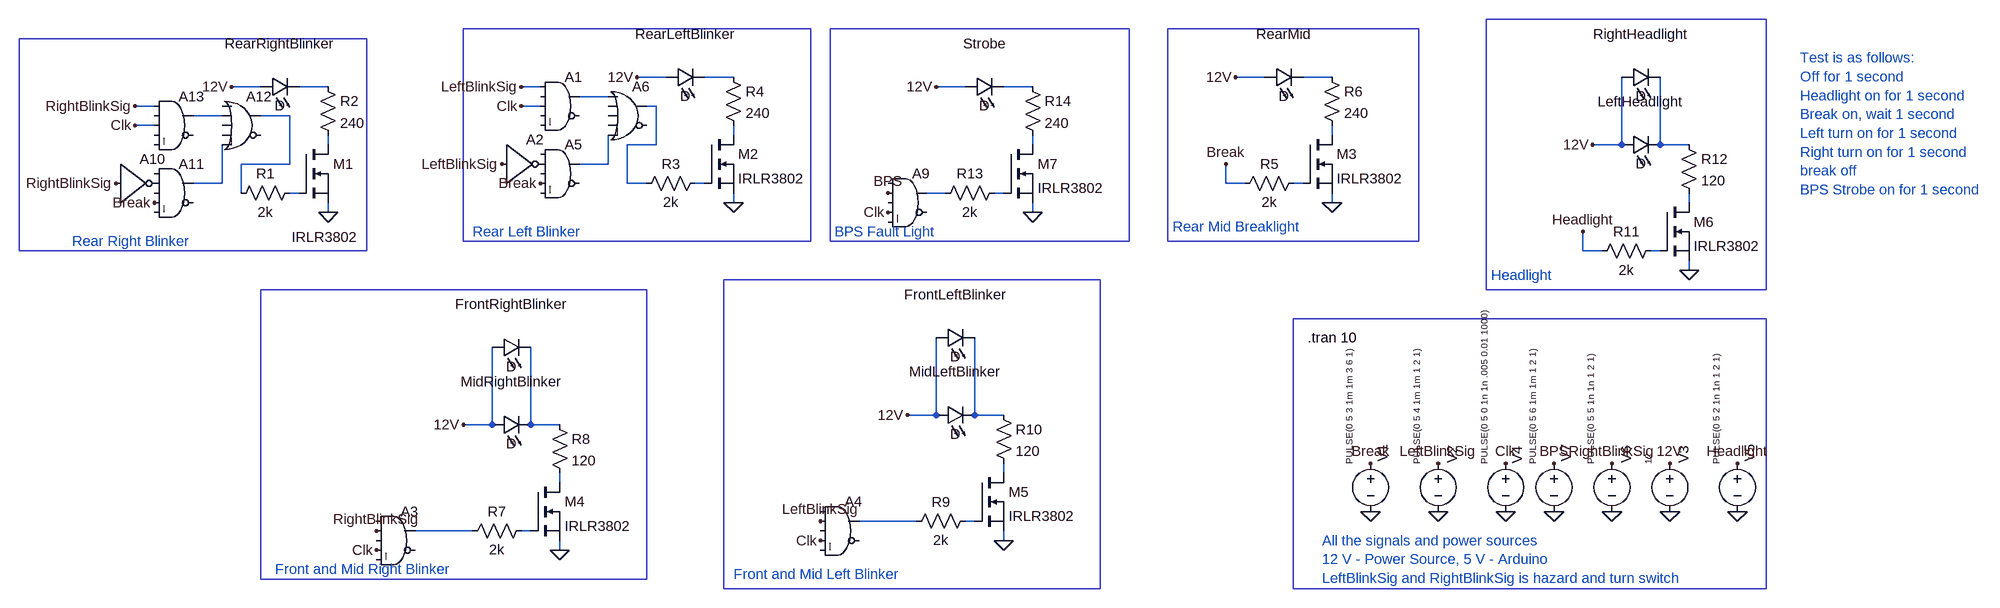
[diagram p0: schematic Lighting_System_LTSpice.asc]
Lighting_System_LTSpice.asc, the LTspice schematic file:
Version 4
SHEET 1 2324 832
WIRE -1680 -1456 -1728 -1456
WIRE -1568 -1456 -1616 -1456
WIRE -688 -1456 -736 -1456
WIRE -576 -1456 -624 -1456
WIRE -2352 -1440 -2400 -1440
WIRE -2240 -1440 -2288 -1440
WIRE -1888 -1440 -1920 -1440
WIRE -1184 -1440 -1232 -1440
WIRE -1072 -1440 -1120 -1440
WIRE -1776 -1424 -1824 -1424
WIRE -2528 -1408 -2560 -1408
WIRE -1888 -1408 -1920 -1408
WIRE -1696 -1408 -1712 -1408
WIRE -2416 -1392 -2464 -1392
WIRE -2304 -1392 -2352 -1392
WIRE -2528 -1376 -2560 -1376
WIRE -1568 -1360 -1568 -1376
WIRE -576 -1360 -576 -1376
WIRE -2240 -1344 -2240 -1360
WIRE -1696 -1344 -1696 -1408
WIRE -1696 -1344 -1744 -1344
WIRE -1072 -1344 -1072 -1360
WIRE -96 -1344 -96 -1456
WIRE -96 -1344 -144 -1344
WIRE -32 -1344 -32 -1456
WIRE 16 -1344 -32 -1344
WIRE -2304 -1312 -2304 -1392
WIRE -2304 -1312 -2384 -1312
WIRE -1776 -1312 -1776 -1360
WIRE -1776 -1312 -1824 -1312
WIRE -2416 -1280 -2416 -1344
WIRE -2416 -1280 -2464 -1280
WIRE -1744 -1280 -1744 -1344
WIRE -1712 -1280 -1744 -1280
WIRE -1616 -1280 -1632 -1280
WIRE -752 -1280 -752 -1312
WIRE -720 -1280 -752 -1280
WIRE -624 -1280 -640 -1280
WIRE -2384 -1264 -2384 -1312
WIRE -2288 -1264 -2304 -1264
WIRE -1216 -1264 -1248 -1264
WIRE -1120 -1264 -1136 -1264
WIRE -1568 -1248 -1568 -1264
WIRE -576 -1248 -576 -1264
WIRE 16 -1248 16 -1264
WIRE -2240 -1232 -2240 -1248
WIRE -1072 -1232 -1072 -1248
WIRE -160 -1168 -160 -1200
WIRE -128 -1168 -160 -1168
WIRE -32 -1168 -48 -1168
WIRE 16 -1136 16 -1152
WIRE -1232 -896 -1232 -1024
WIRE -1232 -896 -1280 -896
WIRE -1168 -896 -1168 -1024
WIRE -1120 -896 -1168 -896
WIRE -1968 -880 -1968 -1008
WIRE -1968 -880 -2016 -880
WIRE -1904 -880 -1904 -1008
WIRE -1856 -880 -1904 -880
WIRE -1120 -800 -1120 -816
WIRE -1856 -784 -1856 -800
WIRE -1264 -720 -1360 -720
WIRE -1168 -720 -1184 -720
WIRE -2000 -704 -2096 -704
WIRE -1904 -704 -1920 -704
WIRE -1120 -688 -1120 -704
WIRE -1856 -672 -1856 -688
FLAG -400 -816 LeftBlinkSig
FLAG -288 -816 Clk
FLAG -512 -816 Break
FLAG -512 -736 0
FLAG -400 -736 0
FLAG -288 -736 0
FLAG -1568 -1248 0
FLAG -1728 -1456 12V
FLAG -112 -816 RightBlinkSig
FLAG -112 -736 0
FLAG -16 -816 12V
FLAG -16 -736 0
FLAG 96 -816 Headlight
FLAG 96 -736 0
FLAG -576 -1248 0
FLAG -736 -1456 12V
FLAG -752 -1312 Break
FLAG -1856 -672 0
FLAG -2016 -880 12V
FLAG -2160 -672 Clk
FLAG -2160 -704 RightBlinkSig
FLAG -1120 -688 0
FLAG -1280 -896 12V
FLAG -1424 -688 Clk
FLAG -1424 -720 LeftBlinkSig
FLAG 16 -1136 0
FLAG -144 -1344 12V
FLAG -160 -1200 Headlight
FLAG -1072 -1232 0
FLAG -1232 -1440 12V
FLAG -208 -816 BPS
FLAG -208 -736 0
FLAG -2240 -1232 0
FLAG -2400 -1440 12V
FLAG -1312 -1232 Clk
FLAG -1312 -1264 BPS
FLAG -2560 -1376 Clk
FLAG -2560 -1408 RightBlinkSig
FLAG -2528 -1248 Break
FLAG -2592 -1280 RightBlinkSig
FLAG -1920 -1408 Clk
FLAG -1920 -1440 LeftBlinkSig
FLAG -1888 -1280 Break
FLAG -1952 -1312 LeftBlinkSig
SYMBOL voltage -512 -832 R0
WINDOW 0 21 14 VLeft 2
WINDOW 3 -35 18 VLeft 1
WINDOW 123 0 0 Left 0
WINDOW 39 0 0 Left 0
SYMATTR InstName V1
SYMATTR Value PULSE(0 5 3 1m 1m 3 6 1)
SYMBOL voltage -400 -832 R0
WINDOW 0 24 16 VLeft 2
WINDOW 3 -35 18 VLeft 1
WINDOW 123 0 0 Left 0
WINDOW 39 0 0 Left 0
SYMATTR InstName V2
SYMATTR Value PULSE(0 5 4 1m 1m 1 2 1)
SYMBOL voltage -288 -832 R0
WINDOW 0 20 17 VLeft 2
WINDOW 3 -35 18 VLeft 1
WINDOW 123 0 0 Left 0
WINDOW 39 0 0 Left 0
SYMATTR InstName V4
SYMATTR Value PULSE(0 5 0 1n 1n .005 0.01 1000)
SYMBOL nmos -1616 -1360 R0
SYMATTR InstName M2
SYMATTR Value IRLR3802
SYMBOL res -1616 -1296 R90
WINDOW 0 0 56 VBottom 2
WINDOW 3 32 56 VTop 2
SYMATTR InstName R3
SYMATTR Value 2k
SYMBOL res -1584 -1472 R0
SYMATTR InstName R4
SYMATTR Value 240
SYMBOL voltage -112 -832 R0
WINDOW 0 24 16 VLeft 2
WINDOW 3 -35 18 VLeft 1
WINDOW 123 0 0 Left 0
WINDOW 39 0 0 Left 0
SYMATTR InstName V6
SYMATTR Value PULSE(0 5 5 1n 1n 1 2 1)
SYMBOL LED -1680 -1440 R270
WINDOW 0 72 32 VTop 2
WINDOW 3 0 32 VBottom 2
SYMATTR InstName RearLeftBlinker
SYMBOL voltage -16 -832 R0
WINDOW 0 24 16 VLeft 2
WINDOW 3 -35 18 VLeft 1
WINDOW 123 0 0 Left 0
WINDOW 39 0 0 Left 0
SYMATTR InstName V3
SYMATTR Value 12
SYMBOL voltage 96 -832 R0
WINDOW 0 21 14 VLeft 2
WINDOW 3 -35 18 VLeft 1
WINDOW 123 0 0 Left 0
WINDOW 39 0 0 Left 0
SYMATTR InstName V5
SYMATTR Value PULSE(0 5 2 1n 1n 1 2 1)
SYMBOL nmos -624 -1360 R0
SYMATTR InstName M3
SYMATTR Value IRLR3802
SYMBOL res -624 -1296 R90
WINDOW 0 0 56 VBottom 2
WINDOW 3 32 56 VTop 2
SYMATTR InstName R5
SYMATTR Value 2k
SYMBOL res -592 -1472 R0
SYMATTR InstName R6
SYMATTR Value 240
SYMBOL LED -688 -1440 R270
WINDOW 0 72 32 VTop 2
WINDOW 3 0 32 VBottom 2
SYMATTR InstName RearMid
SYMBOL nmos -1904 -784 R0
SYMATTR InstName M4
SYMATTR Value IRLR3802
SYMBOL res -1904 -720 R90
WINDOW 0 0 56 VBottom 2
WINDOW 3 32 56 VTop 2
SYMATTR InstName R7
SYMATTR Value 2k
SYMBOL res -1872 -896 R0
SYMATTR InstName R8
SYMATTR Value 120
SYMBOL LED -1968 -864 R270
WINDOW 0 72 32 VTop 2
WINDOW 3 0 32 VBottom 2
SYMATTR InstName MidRightBlinker
SYMBOL Digital\\and -2128 -752 R0
SYMATTR InstName A3
SYMATTR SpiceLine Vhigh=5
SYMBOL LED -1968 -992 R270
WINDOW 0 72 32 VTop 2
WINDOW 3 0 32 VBottom 2
SYMATTR InstName FrontRightBlinker
SYMBOL nmos -1168 -800 R0
SYMATTR InstName M5
SYMATTR Value IRLR3802
SYMBOL res -1168 -736 R90
WINDOW 0 0 56 VBottom 2
WINDOW 3 32 56 VTop 2
SYMATTR InstName R9
SYMATTR Value 2k
SYMBOL res -1136 -912 R0
SYMATTR InstName R10
SYMATTR Value 120
SYMBOL LED -1232 -880 R270
WINDOW 0 72 32 VTop 2
WINDOW 3 0 32 VBottom 2
SYMATTR InstName MidLeftBlinker
SYMBOL Digital\\and -1392 -768 R0
SYMATTR InstName A4
SYMATTR SpiceLine Vhigh=5
SYMBOL LED -1232 -1008 R270
WINDOW 0 72 32 VTop 2
WINDOW 3 0 32 VBottom 2
SYMATTR InstName FrontLeftBlinker
SYMBOL nmos -32 -1248 R0
SYMATTR InstName M6
SYMATTR Value IRLR3802
SYMBOL res -32 -1184 R90
WINDOW 0 0 56 VBottom 2
WINDOW 3 32 56 VTop 2
SYMATTR InstName R11
SYMATTR Value 2k
SYMBOL res 0 -1360 R0
SYMATTR InstName R12
SYMATTR Value 120
SYMBOL LED -96 -1328 R270
WINDOW 0 72 32 VTop 2
WINDOW 3 0 32 VBottom 2
SYMATTR InstName LeftHeadlight
SYMBOL LED -96 -1440 R270
WINDOW 0 72 32 VTop 2
WINDOW 3 0 32 VBottom 2
SYMATTR InstName RightHeadlight
SYMBOL nmos -1120 -1344 R0
SYMATTR InstName M7
SYMATTR Value IRLR3802
SYMBOL res -1120 -1280 R90
WINDOW 0 0 56 VBottom 2
WINDOW 3 32 56 VTop 2
SYMATTR InstName R13
SYMATTR Value 2k
SYMBOL res -1088 -1456 R0
SYMATTR InstName R14
SYMATTR Value 240
SYMBOL LED -1184 -1424 R270
WINDOW 0 72 32 VTop 2
WINDOW 3 0 32 VBottom 2
SYMATTR InstName Strobe
SYMBOL voltage -208 -832 R0
WINDOW 0 21 14 VLeft 2
WINDOW 3 -35 18 VLeft 1
WINDOW 123 0 0 Left 0
WINDOW 39 0 0 Left 0
SYMATTR InstName V7
SYMATTR Value PULSE(0 5 6 1m 1m 1 2 1)
SYMBOL nmos -2288 -1344 R0
WINDOW 3 -12 153 Left 2
SYMATTR InstName M1
SYMATTR Value IRLR3802
SYMBOL res -2288 -1280 R90
WINDOW 0 0 56 VBottom 2
WINDOW 3 32 56 VTop 2
SYMATTR InstName R1
SYMATTR Value 2k
SYMBOL res -2256 -1456 R0
SYMATTR InstName R2
SYMATTR Value 240
SYMBOL LED -2352 -1424 R270
WINDOW 0 72 32 VTop 2
WINDOW 3 0 32 VBottom 2
SYMATTR InstName RearRightBlinker
SYMBOL Digital\\and -1280 -1312 R0
SYMATTR InstName A9
SYMATTR SpiceLine Vhigh=5
SYMBOL Digital\\and -2496 -1440 R0
SYMATTR InstName A13
SYMATTR SpiceLine Vhigh=5V
SYMBOL Digital\\inv -2592 -1344 R0
SYMATTR InstName A10
SYMATTR SpiceLine Vhigh=5V
SYMBOL Digital\\and -2496 -1328 R0
SYMATTR InstName A11
SYMATTR SpiceLine Vhigh=5V
SYMBOL Digital\\or -2384 -1440 R0
SYMATTR InstName A12
SYMATTR SpiceLine Vhigh=5V
SYMBOL Digital\\and -1856 -1472 R0
SYMATTR InstName A1
SYMATTR SpiceLine Vhigh=5V
SYMBOL Digital\\inv -1952 -1376 R0
SYMATTR InstName A2
SYMATTR SpiceLine Vhigh=5V
SYMBOL Digital\\and -1856 -1360 R0
SYMATTR InstName A5
SYMATTR SpiceLine Vhigh=5V
SYMBOL Digital\\or -1744 -1456 R0
SYMATTR InstName A6
SYMATTR SpiceLine Vhigh=5V
TEXT -616 -1024 Left 2 !.tran 10
TEXT -592 -688 Left 2 ;All the signals and power sources\n12 V - Power Source, 5 V - Arduino\nLeftBlinkSig and RightBlinkSig is hazard and turn switch
TEXT -2664 -1184 Left 2 ;Rear Right Blinker
TEXT -2000 -1200 Left 2 ;Rear Left Blinker
TEXT -1400 -1200 Left 2 ;BPS Fault Light
TEXT -840 -1208 Left 2 ;Rear Mid Breaklight
TEXT -312 -1128 Left 2 ;Headlight
TEXT -1568 -632 Left 2 ;Front and Mid Left Blinker
TEXT -2328 -640 Left 2 ;Front and Mid Right Blinker
TEXT 200 -1488 Left 2 ;Test is as follows:\nOff for 1 second\nHeadlight on for 1 second\nBreak on, wait 1 second\nLeft turn on for 1 second\nRight turn on for 1 second\nbreak off\nBPS Strobe on for 1 second
RECTANGLE Normal -2016 -1184 -1440 -1536
RECTANGLE Normal -2352 -624 -1712 -1104
RECTANGLE Normal -848 -1536 -432 -1184
RECTANGLE Normal 144 -1552 -320 -1104
RECTANGLE Normal 144 -608 -640 -1056
RECTANGLE Normal -2752 -1168 -2176 -1520
RECTANGLE Normal -912 -1536 -1408 -1184
RECTANGLE Normal -960 -1120 -1584 -608

The netlist it stands for:
* Lighting_System_LTSpice.asc
V1 Break 0 PULSE(0 5 3 1m 1m 3 6 1)
V2 LeftBlinkSig 0 PULSE(0 5 4 1m 1m 1 2 1)
V4 Clk 0 PULSE(0 5 0 1n 1n .005 0.01 1000)
M2 N009 N016 0 0 IRLR3802
R3 N016 N006 2k
R4 N001 N009 240
V6 RightBlinkSig 0 PULSE(0 5 5 1n 1n 1 2 1)
D§RearLeftBlinker 12V N001 D
V3 12V 0 12
V5 Headlight 0 PULSE(0 5 2 1n 1n 1 2 1)
M3 N010 N017 0 0 IRLR3802
R5 N017 Break 2k
R6 N002 N010 240
D§RearMid 12V N002 D
M4 N026 N030 0 0 IRLR3802
R7 N030 N029 2k
R8 N024 N026 120
D§MidRightBlinker 12V N024 D
A3 0 RightBlinkSig 0 Clk 0 0 N029 0 AND Vhigh=5
D§FrontRightBlinker 12V N024 D
M5 N025 N028 0 0 IRLR3802
R9 N028 N027 2k
R10 N023 N025 120
D§MidLeftBlinker 12V N023 D
A4 0 LeftBlinkSig 0 Clk 0 0 N027 0 AND Vhigh=5
D§FrontLeftBlinker 12V N023 D
M6 N021 N022 0 0 IRLR3802
R11 N022 Headlight 2k
R12 N013 N021 120
D§LeftHeadlight 12V N013 D
D§RightHeadlight 12V N013 D
M7 N012 N020 0 0 IRLR3802
R13 N020 N019 2k
R14 N004 N012 240
D§Strobe 12V N004 D
V7 BPS 0 PULSE(0 5 6 1m 1m 1 2 1)
M1 N011 N018 0 0 IRLR3802
R1 N018 N008 2k
R2 N003 N011 240
D§RearRightBlinker 12V N003 D
A9 0 BPS 0 Clk 0 0 N019 0 AND Vhigh=5
A13 RightBlinkSig 0 Clk 0 0 0 N007 0 AND Vhigh=5V
A10 RightBlinkSig 0 0 0 0 P001 0 0 BUF Vhigh=5V
A11 0 P001 0 Break 0 0 N015 0 AND Vhigh=5V
A12 0 N007 0 0 N015 0 N008 0 OR Vhigh=5V
A1 LeftBlinkSig 0 Clk 0 0 0 N005 0 AND Vhigh=5V
A2 LeftBlinkSig 0 0 0 0 P002 0 0 BUF Vhigh=5V
A5 0 P002 0 Break 0 0 N014 0 AND Vhigh=5V
A6 N005 0 0 0 N014 0 N006 0 OR Vhigh=5V
.model D D
.lib standard.dio
.model NMOS NMOS
.model PMOS PMOS
.lib standard.mos
.tran 10
* All the signals and power sources
* 12 V - Power Source, 5 V - Arduino
* LeftBlinkSig and RightBlinkSig is hazard and turn switch
* Rear Right Blinker
* Rear Left Blinker
* BPS Fault Light
* Rear Mid Breaklight
* Headlight
* Front and Mid Left Blinker
* Front and Mid Right Blinker
* Test is as follows:
* Off for 1 second
* Headlight on for 1 second
* Break on, wait 1 second
* Left turn on for 1 second
* Right turn on for 1 second
* break off
* BPS Strobe on for 1 second
.backanno
.end